# EAGLE design PX2IO (EAGLE 5.11)
BOM: EXCLUDE; PARTNO: *
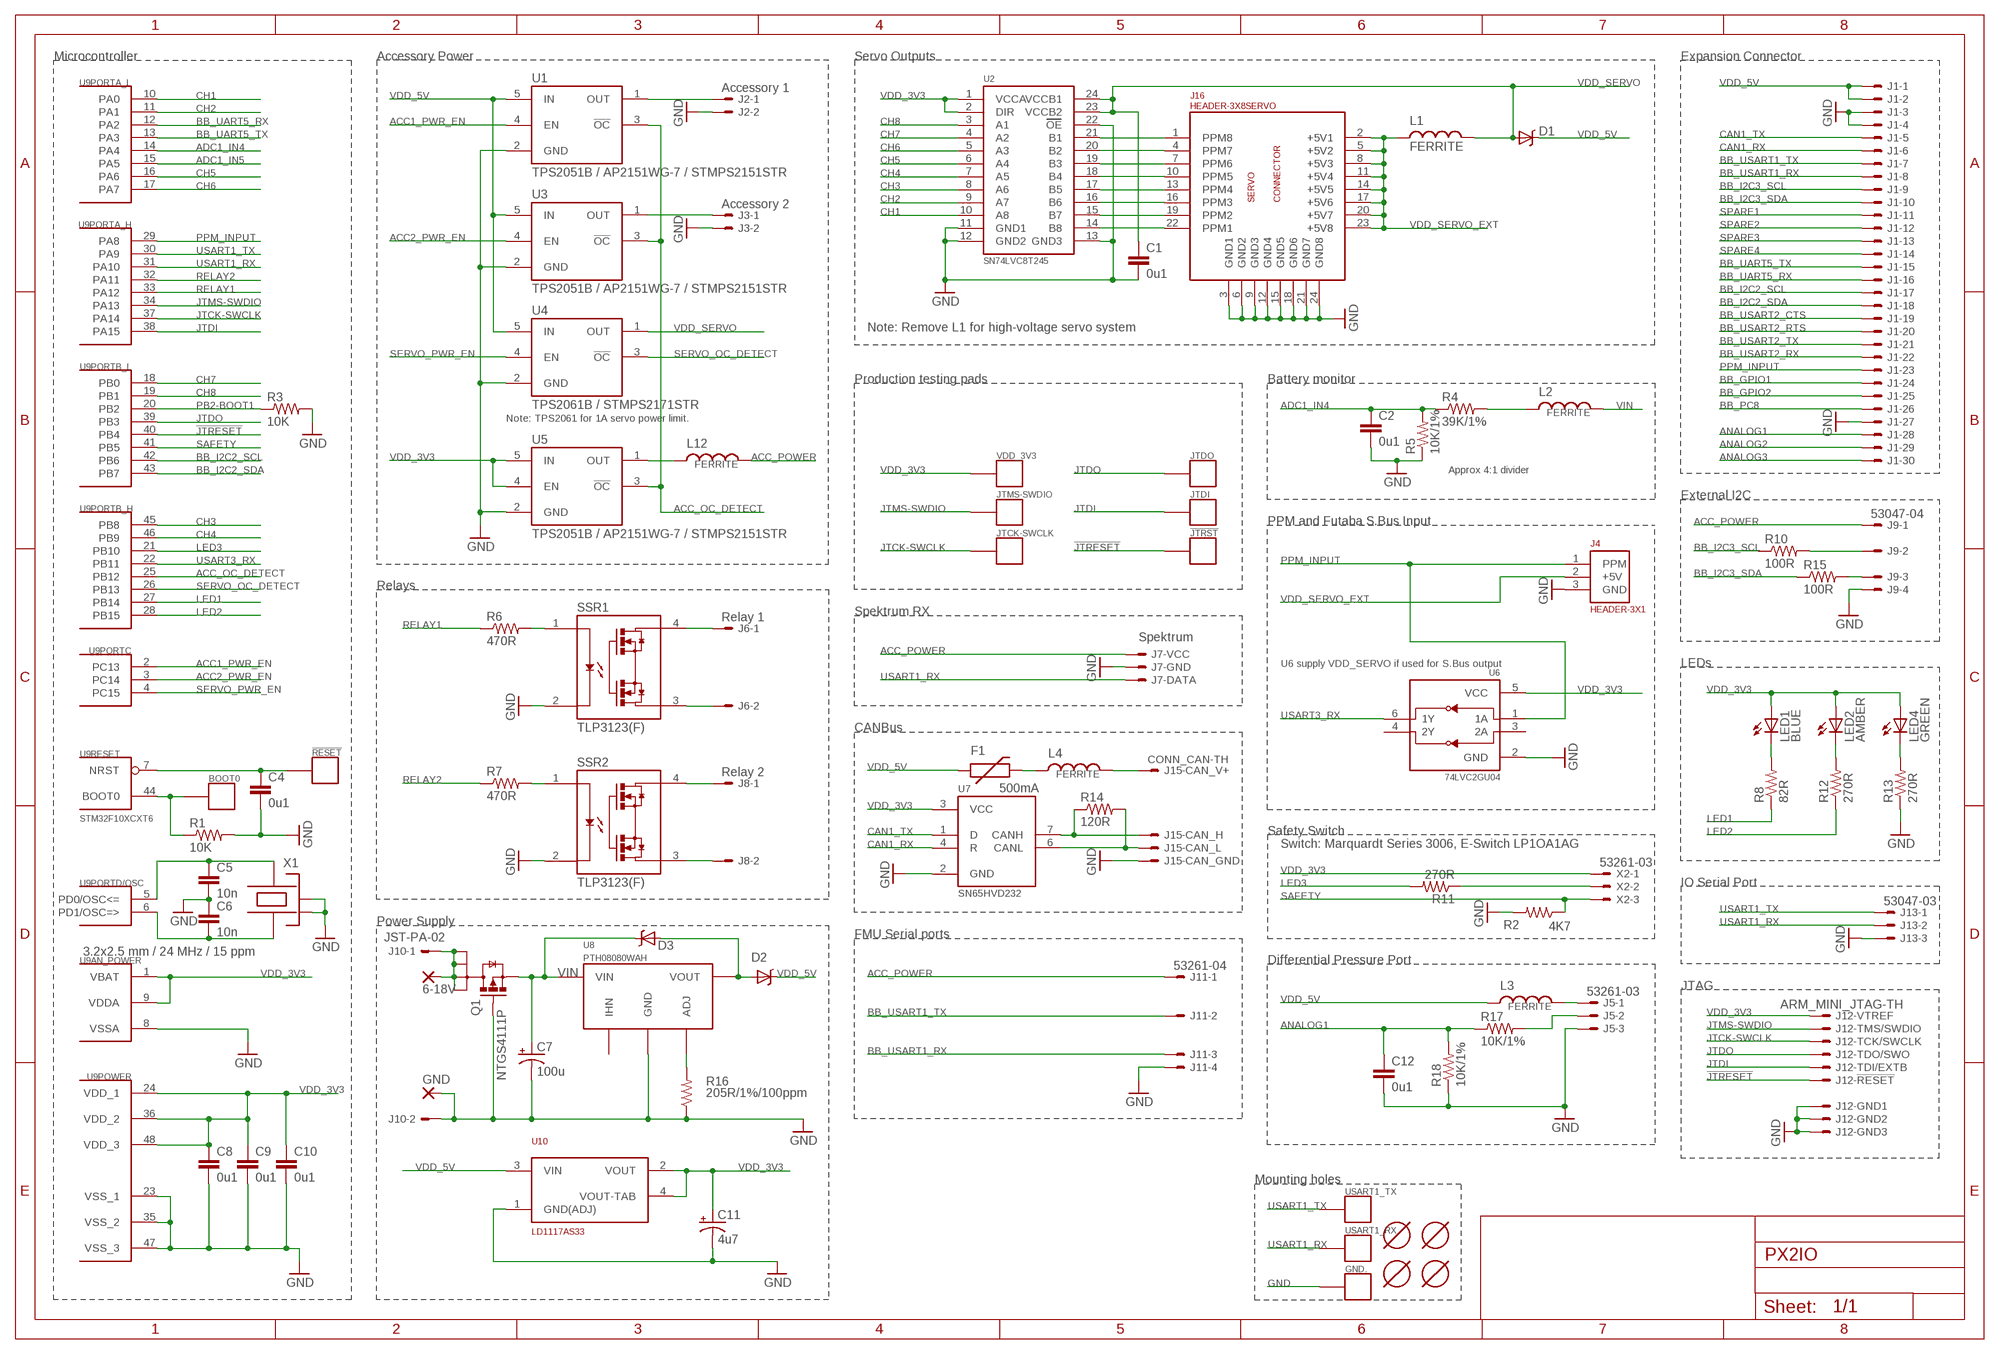
[diagram p0: schematic, sheet 1]

## Parts
6-18V  WIREPADSMD3,5-2  [3,5-2]
!JTRST  PAD.03  [PAD.03X.03]
!RESET  PAD.03  [PAD.03X.03]
BOOT0  PAD.03  [PAD.03X.03]
C1  0u1  CAP0402-CAP  [0402-CAP]
C2  0u1  CAP0402-CAP  [0402-CAP]
C4  0u1  CAP0402-CAP  [0402-CAP]
C5  10n  CAP0402-CAP  [0402-CAP]
C6  10n  CAP0402-CAP  [0402-CAP]
C7  100u  CAP_POL7343  [EIA7343]
C8  0u1  CAP0402-CAP  [0402-CAP]
C9  0u1  CAP0402-CAP  [0402-CAP]
C10  0u1  CAP0402-CAP  [0402-CAP]
C11  4u7  CAP_POL1206  [EIA3216]
C12  0u1  CAP0402-CAP  [0402-CAP]
D1  DIODE-SCHOTTKY_MSMP  [MICROSMP]
D2  DIODE-SCHOTTKY_MSMP  [MICROSMP]
D3  DIODE-SCHOTTKY_MSMP  [MICROSMP]
F1  500mA  PTC0603  [0603]
GND  WIREPADSMD3,5-2  [3,5-2]
GND.  PAD.03  [PAD.03X.03]
J1  HEADER_2X15-REV  [HEADER_2MM_2X15_REVERSE]
J2  Accessory 1  53047-02  [53047-02]
J3  Accessory 2  53047-02  [53047-02]
J4  HEADER-3X1  [3X1RA]
J5  53261-03  [53261-03]
J6  Relay 1  53047-02  [53047-02]
J7  CONN_SPEKTRUM_RX-TH  [B3B-ZR]
J8  Relay 2  53047-02  [53047-02]
J9  53047-04  [53047-04]
J10  JST-PA-02  [S02B-PASK-2]
J11  53261-04  [53261-04]
J12  ARM_MINI_JTAG-TH  [FTSH-105-01-XXX-DV]
J13  53047-03  [53047-03]
J15  CONN_CAN-TH  [B4B-PH-K-S]
J16  HEADER-3X8SERVO  [3X8RA]
JTCK-SWCLK  PAD.03  [PAD.03X.03]
JTDI  PAD.03  [PAD.03X.03]
JTDO  PAD.03  [PAD.03X.03]
JTMS-SWDIO  PAD.03  [PAD.03X.03]
L1  FERRITE  INDUCTOR0402  [0402-IND]
L2  FERRITE  INDUCTOR0402  [0402-IND]
L3  FERRITE  INDUCTOR0402  [0402-IND]
L4  FERRITE  INDUCTOR0402  [0402-IND]
L12  FERRITE  INDUCTOR0402  [0402-IND]
LED1  BLUE  LED0603  [LED-0603]
LED2  AMBER  LED0603  [LED-0603]
LED4  GREEN  LED0603  [LED-0603]
Q1  NTGS4111P  [TSOP-6]
R1  10K  RESISTOR0402-RES  [0402-RES]
R2  4K7  RESISTOR0402-RES  [0402-RES]
R3  10K  RESISTOR0402-RES  [0402-RES]
R4  39K/1%  RESISTOR0402-RES  [0402-RES]
R5  10K/1%  RESISTOR0402-RES  [0402-RES]
R6  470R  RESISTOR0402-RES  [0402-RES]
R7  470R  RESISTOR0402-RES  [0402-RES]
R8  82R  RESISTOR0402-RES  [0402-RES]
R10  100R  RESISTOR0402-RES  [0402-RES]
R11  270R  RESISTOR0402-RES  [0402-RES]
R12  270R  RESISTOR0402-RES  [0402-RES]
R13  270R  RESISTOR0402-RES  [0402-RES]
R14  120R  RESISTOR0402-RES  [0402-RES]
R15  100R  RESISTOR0402-RES  [0402-RES]
R16  205R/1%/100ppm  RESISTOR0402-RES  [0402-RES]
R17  10K/1%  RESISTOR0402-RES  [0402-RES]
R18  10K/1%  RESISTOR0402-RES  [0402-RES]
SSR1  TLP3123(F)  TLP3123SO  [SOP4-2.54]
SSR2  TLP3123(F)  TLP3123SO  [SOP4-2.54]
U1  TPS2051B / AP2151WG-7 / STMPS2151STR  TPS2051B  [SOT23-5L]
U2  SN74LVC8T245  [R-PDSO-G24]
U3  TPS2051B / AP2151WG-7 / STMPS2151STR  TPS2051B  [SOT23-5L]
U4  TPS2061B / STMPS2171STR  TPS2051B  [SOT23-5L]
U5  TPS2051B / AP2151WG-7 / STMPS2151STR  TPS2051B  [SOT23-5L]
U6  74LVC2GU04  [SOT363_PHILIPS]
U7  SN65HVD232  [SO08]
U8  PTH08080WAH  [PTH08080W_TH]
U9  STM32F10XCXT6  [TQFP48]
U10  LD1117AS33  [SOT-223]
U$2  MOUNT-HOLE2.1MM  [MOUNT-HOLE2.1]
U$3  MOUNT-HOLE2.1MM  [MOUNT-HOLE2.1]
U$4  MOUNT-HOLE2.1MM  [MOUNT-HOLE2.1]
U$5  MOUNT-HOLE2.1MM  [MOUNT-HOLE2.1]
USART1_RX  PAD.03  [PAD.03X.03]
USART1_TX  PAD.03  [PAD.03X.03]
VDD_3V3  PAD.03  [PAD.03X.03]
X1  3.2x2.5 mm / 24 MHz / 15 ppm  OSCILLATOR-3.2X2.5  [OSCILLATOR-3.2X2.5]
X2  53261-03  [53261-03]

## Nets
!JTRESET: !JTRST.P$1 J12.10 U9.40(PORTB_L:PB4)
ACC1_PWR_EN: U1.4(EN) U9.2(PORTC:PC13)
ACC2_PWR_EN: U3.4(EN) U9.3(PORTC:PC14)
ACC_OC_DETECT: U1.3(!OC) U3.3(!OC) U5.3(!OC) U9.25(PORTB_H:PB12)
ACC_POWER [power]: J7.3 J9.1 J11.1 L12.2
ADC1_IN4: C2.1 R4.1 R5.2 U9.14(PORTA_L:PA4)
ADC1_IN5: U9.15(PORTA_L:PA5)
ANALOG1: C12.1 J1.28 R17.1 R18.2
ANALOG2: J1.29
ANALOG3: J1.30
BB_GPIO1: J1.24
BB_GPIO2: J1.25
BB_I2C2_SCL: J1.17 U9.42(PORTB_L:PB6)
BB_I2C2_SDA: J1.18 U9.43(PORTB_L:PB7)
BB_I2C3_SCL: J1.9 R10.1
BB_I2C3_SDA: J1.10 R15.1
BB_PC8: J1.26
BB_UART5_RX: J1.16 U9.12(PORTA_L:PA2)
BB_UART5_TX: J1.15 U9.13(PORTA_L:PA3)
BB_USART1_RX: J1.8 J11.3
BB_USART1_TX: J1.7 J11.2
BB_USART2_CTS: J1.19
BB_USART2_RTS: J1.20
BB_USART2_RX: J1.22
BB_USART2_TX: J1.21
BOOT0: BOOT0.P$1 R1.1 U9.44(RESET:BOOT0)
CAN1_RX: J1.6 U7.4(R)
CAN1_TX: J1.5 U7.1(D)
CH1: U2.10(A8) U9.10(PORTA_L:PA0)
CH2: U2.9(A7) U9.11(PORTA_L:PA1)
CH3: U2.8(A6) U9.45(PORTB_H:PB8)
CH4: U2.7(A5) U9.46(PORTB_H:PB9)
CH5: U2.6(A4) U9.16(PORTA_L:PA6)
CH6: U2.5(A3) U9.17(PORTA_L:PA7)
CH7: U2.4(A2) U9.18(PORTB_L:PB0)
CH8: U2.3(A1) U9.19(PORTB_L:PB1)
GND [power]: C1.2 C2.2 C4.2 C5.2 C6.1 C7.C(-) C8.2 C9.2 C10.2 C11.C(-) C12.2 GND.1(P) GND..P$1 J1.3 J1.4 J1.27 J2.2 J3.2 J4.3(GND) J5.3 J7.2 J9.4 J10.2 J11.4 J12.3 J12.5 J12.9 J13.3 J15.4 J16.3(GND1) J16.6(GND2) J16.9(GND3) J16.12(GND4) J16.15(GND5) J16.18(GND6) J16.21(GND7) J16.24(GND8) Q1.3(G) R1.2 R2.2 R3.2 R5.1 R13.1 R16.1 R18.1 SSR1.2 SSR2.2 U1.2(GND) U2.11(GND1) U2.12(GND2) U2.13(GND3) U2.22(OE) U3.2(GND) U4.2(GND) U5.2(GND) U6.2(GND) U7.2(GND) U8.2(GND) U9.8(AN_POWER:VSSA) U9.23(POWER:VSS_1) U9.35(POWER:VSS_2) U9.47(POWER:VSS_3) U10.1(GND(ADJ)) X1.2(NC_2) X1.4(NC_4)
JTCK-SWCLK: J12.4 JTCK-SWCLK.P$1 U9.37(PORTA_H:PA14)
JTDI: J12.8 JTDI.P$1 U9.38(PORTA_H:PA15)
JTDO: J12.6 JTDO.P$1 U9.39(PORTB_L:PB3)
JTMS-SWDIO: J12.2 JTMS-SWDIO.P$1 U9.34(PORTA_H:PA13)
LED1: R8.1 U9.27(PORTB_H:PB14)
LED2: R12.1 U9.28(PORTB_H:PB15)
LED3: R11.2 U9.21(PORTB_H:PB10)
N$1: R7.2 SSR2.1
N$2: R6.2 SSR1.1
N$4 [power]: L12.1 U5.1(OUT)
N$5: C6.2 U9.6(PORTD/OSC:PD1/OSC=>) X1.1
N$6: C5.1 U9.5(PORTD/OSC:PD0/OSC<=) X1.3
N$7: L2.1 R4.2
N$8: LED1.C R8.2
N$9: R16.2 U8.4(ADJ)
N$10: R11.1 X2.2
N$14: F1.2 L4.1
N$15: J5.2 R17.2
N$21 [power]: J8.1 SSR2.4
N$22 [power]: J8.2 SSR2.3
N$23 [power]: J6.2 SSR1.3
N$24 [power]: J6.1 SSR1.4
N$27: J9.3 R15.2
N$28: J9.2 R10.2
N$29 [power]: J2.1 U1.1(OUT)
N$30 [power]: J3.1 U3.1(OUT)
N$31: LED2.C R12.2
N$38: LED4.C R13.2
N$43: J15.2 R14.1 U7.7(CANH)
N$44: J15.3 R14.2 U7.6(CANL)
N$47 [power]: J15.1 L4.2
NRST: !RESET.P$1 C4.1 U9.7(RESET:NRST)
PB2-BOOT1: R3.1 U9.20(PORTB_L:PB2)
PPM1: J16.22(PPM1) U2.14(B8)
PPM2: J16.19(PPM2) U2.15(B7)
PPM3: J16.16(PPM3) U2.16(B6)
PPM4: J16.13(PPM4) U2.17(B5)
PPM5: J16.10(PPM5) U2.18(B4)
PPM6: J16.7(PPM6) U2.19(B3)
PPM7: J16.4(PPM7) U2.20(B2)
PPM8: J16.1(PPM8) U2.21(B1)
PPM_INPUT: J1.23 J4.1(PPM) U6.1(1A) U9.29(PORTA_H:PA8)
RELAY1: R6.1 U9.33(PORTA_H:PA12)
RELAY2: R7.1 U9.32(PORTA_H:PA11)
SAFETY: R2.1 U9.41(PORTB_L:PB5) X2.3
SERVO_OC_DETECT: U4.3(!OC) U9.26(PORTB_H:PB13)
SERVO_PWR_EN: U4.4(EN) U9.4(PORTC:PC15)
SPARE1: J1.11
SPARE2: J1.12
SPARE3: J1.13
SPARE4: J1.14
USART1_RX: J7.1 J13.2 U9.31(PORTA_H:PA10) USART1_RX.P$1
USART1_TX: J13.1 U9.30(PORTA_H:PA9) USART1_TX.P$1
USART3_RX: U6.6(1Y) U9.22(PORTB_H:PB11)
VDD_3V3 [power]: C8.1 C9.1 C10.1 C11.A(+) J12.1 LED1.A LED2.A LED4.A U2.1(VCCA) U2.2(DIR) U5.4(EN) U5.5(IN) U6.5(VCC) U7.3(VCC) U9.1(AN_POWER:VBAT) U9.9(AN_POWER:VDDA) U9.24(POWER:VDD_1) U9.36(POWER:VDD_2) U9.48(POWER:VDD_3) U10.2(VOUT) U10.4(VOUT-TAB) VDD_3V3.P$1 X2.1
VDD_5V [power]: D1.CATHODE(C) D2.CATHODE(C) F1.1 J1.1 J1.2 L3.1 U1.5(IN) U3.5(IN) U4.5(IN) U10.3(VIN)
VDD_5V_ANALOG [power]: J5.1 L3.2
VDD_SERVO [power]: C1.1 D1.ANODE(A) L1.2 U2.23(VCCB2) U2.24(VCCB1) U4.1(OUT)
VDD_SERVO_EXT [power]: J4.2(+5V) J16.2(+5V1) J16.5(+5V2) J16.8(+5V3) J16.11(+5V4) J16.14(+5V5) J16.17(+5V6) J16.20(+5V7) J16.23(+5V8) L1.1
VIN [power]: C7.A(+) D3.CATHODE(C) L2.2 Q1.4(S) U8.1(VIN)
VIN_CONTACT [power]: 6-18V.1(P) J10.1 Q1.1(D) Q1.2(D1) Q1.5(D2) Q1.6(D3)
VOUT: D2.ANODE(A) D3.ANODE(A) U8.3(VOUT)
Unconnected: U6.3(2A) U6.4(2Y) U7.5(NC) U7.8(NC2) U8.5(IHN)

## Notes on the sheet
- Microcontroller | Accessory Power | Servo Outputs | Expansion Connector
- Note: Remove L1 for high-voltage servo system
- Production testing pads | Battery monitor
- Note: TPS2061 for 1A servo power limit.
- Approx 4:1 divider
- External I2C
- PPM and Futaba S.Bus Input
- Relays
- Spektrum RX
- Spektrum
- U6 supply VDD_SERVO if used for S.Bus output | LEDs
- CANBus
- Safety Switch
- Switch: Marquardt Series 3006, E-Switch LP1OA1AG
- IO Serial Port
- Power Supply
- FMU Serial ports
- Differential Pressure Port
- JTAG
- Mounting holes

## Library data of the parts
6-18V GND = pixhawk2:WIREPAD: Wire PAD connect wire on PCB
!JTRST !RESET BOOT0 GND. JTCK-SWCLK JTDI JTDO JTMS-SWDIO USART1_RX USART1_TX VDD_3V3 = pixhawk2:PAD: Test pad This footprint includes three classes: The actual test pads, a pogo-pin footprint to mount the pogo-pin as through-hole part and a hole footprint which allows the head of the pogo-pin to pass through (do NOT use the hole to mount the pogo-pin). In a typical test setup, the stack would consist of three PCBs: The actual PCB under testing with a test pad on the bottom, then a second PCB with the hole for the pogo-pin head where the PCB under testing is pressed on and a third PCB at 30 mm / 1.2" distance with the pogo-pin footprints. The pogo-pins are soldered to the last PCB. To create the stack, copy the board under testing and exchange the footprints - this way the correct positioning is ensured.
C1 C2 C4-C6 C8-C10 C12 = pixhawk2:CAP: Capacitor Standard 0603 ceramic capacitor, and 0.1" leaded capacitor.
C7 C11 = pixhawk2:CAP_POL: Capacitor Polarized These are standard SMD and PTH capacitors. Normally 10uF, 47uF, and 100uF in electrolytic and tantalum varieties. Always verify the external diameter of the through hole cap, it varies with capacity, voltage, and manufacturer. The EIA devices should be standard.
D1-D3 = pixhawk2:DIODE-SCHOTTKY: Schottky barrier diode in DO214AC, e.g. Fairchild SS14.
F1 = pixhawk2:PTC: Resettable Fuse PTC Resettable Fuse. Spark Fun Electronics SKU : COM-08357
J1 = pixhawk2:HEADER_2X15: 2X15 header
J2 J3 J6 J8 = pixhawk2:53?-02: CONNECTOR wire to board 1.25 mm (.049 inch) pitch header
J4 = pixhawk2:HEADER-3X1
J5 J13 X2 = pixhawk2:53?-03: CONNECTOR wire to board 1.25 mm (.049 inch) pitch header
J7 = pixhawk2:CONN_SPEKTRUM_RX: Spektrum RX connector; JST ZH series S3B-ZR-SM4A-TF
J9 J11 = pixhawk2:53?-04: CONNECTOR wire to board 1.25 mm (.049 inch) pitch header
J10 = pixhawk2:JST-PA-02: JST PA Series http://www.jst-mfg.com/product/pdf/eng/ePA-F.pdf
J12 = pixhawk2:ARM_MINI_JTAG: CONNECTOR wire to board 1.25 mm (.049 inch) pitch header
J15 = pixhawk2:CONN_CAN
J16 = pixhawk2:HEADER-3X8
L1-L4 L12 = pixhawk2:INDUCTOR: Inductors Basic Inductor/Choke - 0603 and 1206. Footprints are not proven and vary greatly between part numbers.
LED1 LED2 LED4 = pixhawk2:LED: LEDs Standard schematic elements and footprints for 5mm, 3mm, 1206, and 0603 sized LEDs. 5mm - Spark Fun Electronics SKU : COM-00529 (and others)
Q1 = pixhawk2:NTGS4111P
R1-R8 R10-R18 = pixhawk2:RESISTOR: Resistor Basic schematic elements and footprints for 0603, 1206, and PTH 1/10th watt (small) resistors.
SSR1 SSR2 = pixhawk2:TLP3123: TLP3123 Solid State Relay The TOSHIBA TLP3123 consists of a gallium arsenide infrared emitting diode optically coupled to a photo-MOS FET in a plastic SOP package. The TLP3123 is a bi-directional switch, which can replace mechanical relays in many applications. And its high on-state current maximum rating and low on-state resistance is suitable to control a power line. http://www.semicon.toshiba.co.jp/docs/datasheet/en/Opto/TLP3123_en_datasheet_071001.pdf
U1 U3-U5 = pixhawk2:TPS2051B: CURRENT-LIMITED, POWER-DISTRIBUTION SWITCH The TPS204xB/TPS205xB power-distribution switches are intended for applications where heavy capacitive loads and short circuits are likely to be encountered. 500-mA continuous current, accurate Current Limit (0.75 A min, 1.25 A max), operating range: 2.7 V to 5.5 V. These devices incorporates 70-m? N-channel MOSFET power switches for power-distribution systems that require multiple power switches in a single package. Each switch is controlled by a logic enable input. Gate drive is provided by an internal charge pump designed to control the power-switch rise times and fall times to minimize current surges during switching. The charge pump requires no external components and allows operation from supplies as low as 2.7 V. http://focus.ti.com/lit/ds/symlink/tps2051b.pdf
U2 = pixhawk2:SN74LVC8T245
U6 = pixhawk2:74LVC2GU04: DUAL INVERTER GATE This dual inverter is designed for 1.65-V to 5.5-V VCC operation. The SN74LVC2GU04 contains two inverters with unbuffered outputs and performs the Boolean function Y = A. It is available from NXP and TI. http://www.nxp.com/documents/data_sheet/74LVC2GU04.pdf http://focus.ti.com/lit/ds/symlink/sn74lvc2gu04.pdf
U7 = pixhawk2:SN65HVD232: 3.3-V CAN TRANSCEIVER
U8 = pixhawk2:PTH08080W: 2.25-A, WIDE-INPUT ADJUSTABLE SWITCHING REGULATOR The input voltage range of the PTH08080W is from 4.5 V to 18 V, allowing operation from either a 5-V or 12-V input bus. Using state-of-the-art switched-mode power-conversion technology, the PTH08080W can step down to voltages as low as 0.9 V from a 5-V input bus, with less than 1 W of power dissipation. The output voltage can be adjusted to any voltage over the range, 0.9 V to 5.5 V, using a single external resistor. Operating features include an undervoltage lockout (UVLO), on/off inhibit, overcurrent protection, and overtemperature protection. http://focus.ti.com/lit/ds/symlink/pth08080w.pdf
U9 = pixhawk2:STM32F10XCXT6: ST STM32F101/103 48pin LQFP
U10 = pixhawk2:LD1117A: LD1117A LDO Datasheet: http://www.st.com/stonline/books/pdf/docs/7194.pdf
U$2-U$5 = pixhawk2:MOUNT-HOLE
X1 = pixhawk2:OSCILLATOR: Crystal Oscillator in 3.2x2.5 SMD

## Net classes
0 signal: width 0.203 mm, drill 0.3 mm, clearance 0.203 mm
1 power: width 0.254 mm, drill 0.3 mm, clearance 0.203 mm

## Board
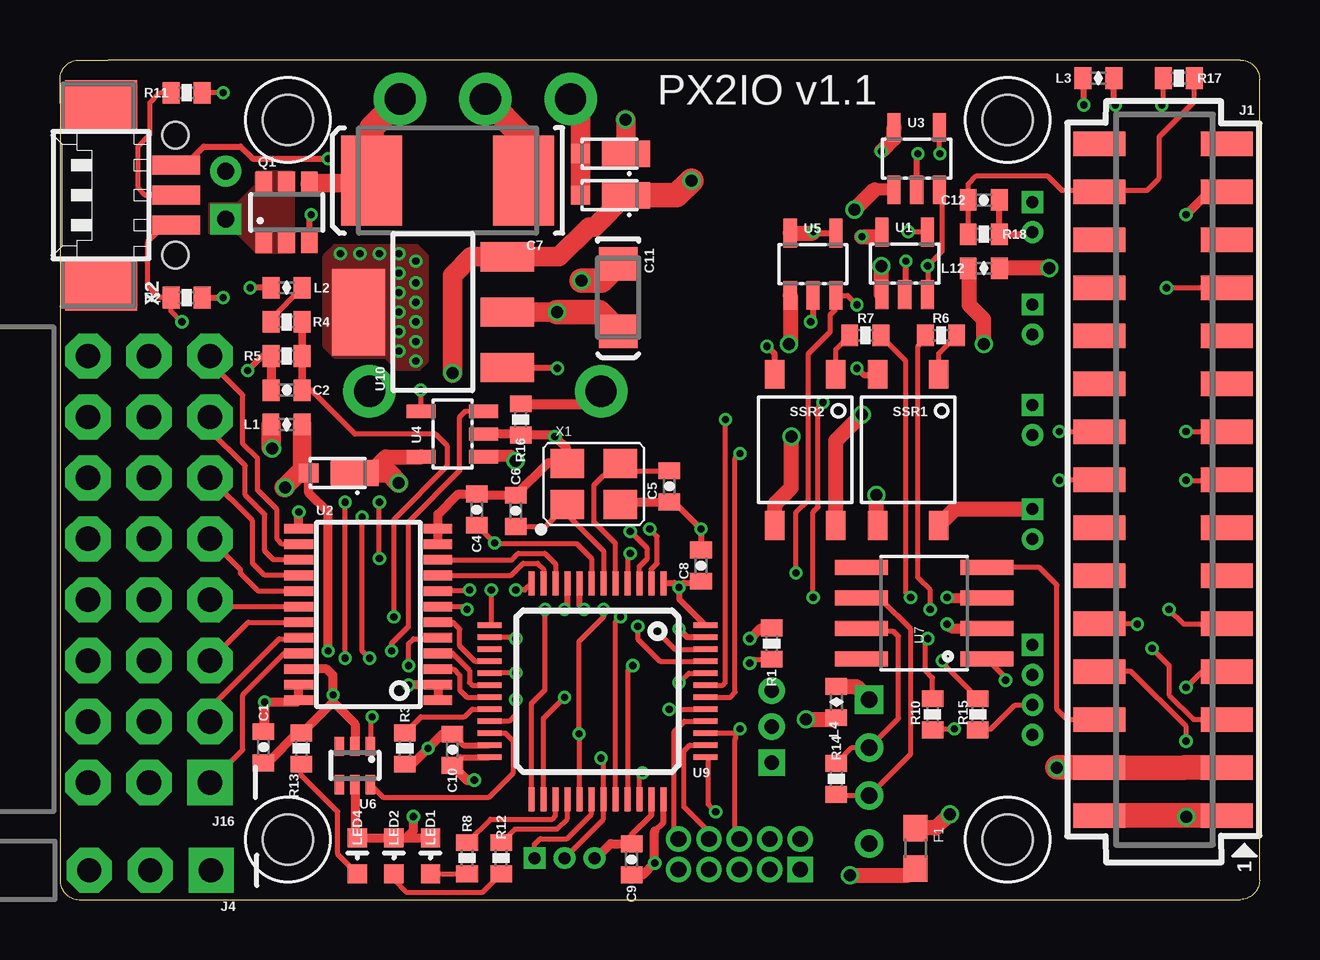
[diagram p1: board, top side]
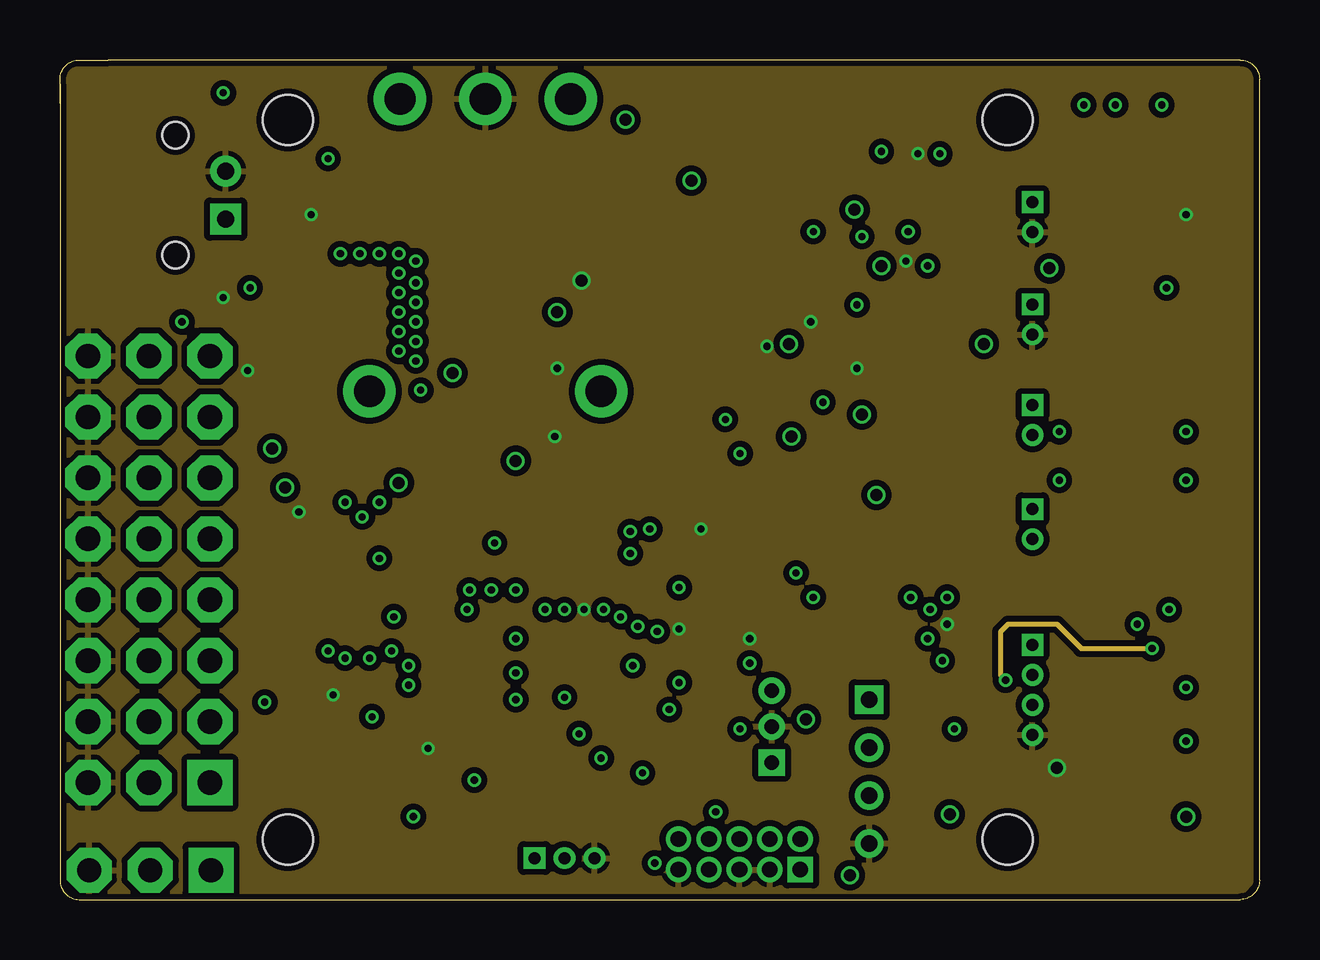
[diagram p2: board, inner layer Route2]
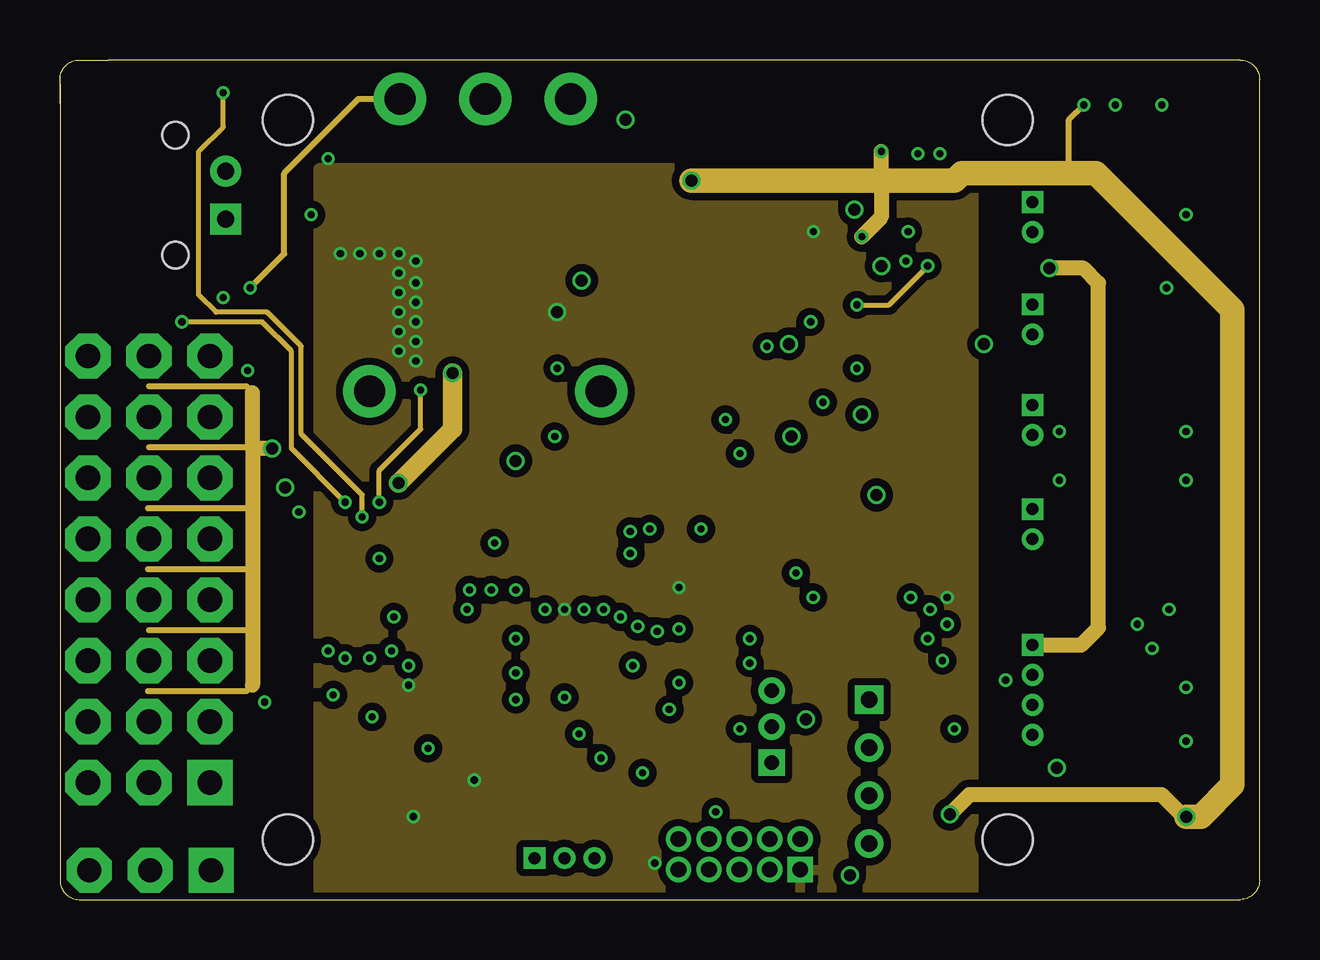
[diagram p3: board, inner layer Route15]
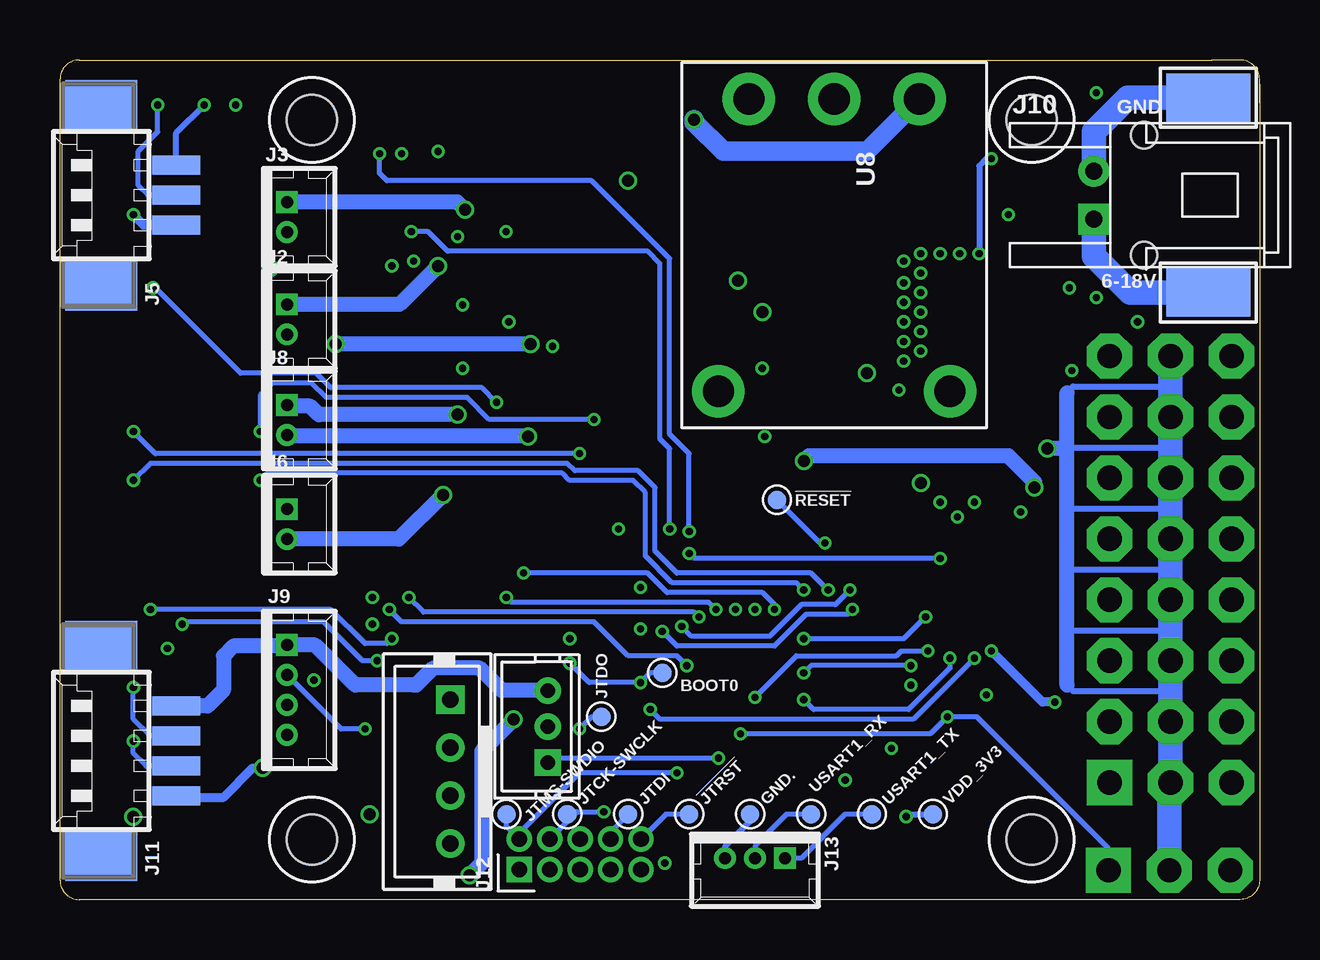
[diagram p4: board, bottom side, seen from below]

Size 50 x 35 mm. Coordinates in mm from the lower left corner, seen from the top.
Outline: 0,33.2 0,34.2 arc-90 0.8,35 1,35 2,35 35.2,35
Outline: 0,34 0,0.8 arc90 0.8,0 49.2,0 arc90 50,0.8 50,34.2 arc90 49.2,35 35.21,35
Copper layers (1*2*15*16): Top 0.035mm / dielectric 0.5mm / Route2 0.035mm / dielectric 0.5mm / Route15 0.035mm / dielectric 0.5mm / Bottom 0.035mm
Design rules "pixhawk2 *": minimum track width 0.15mm, minimum drill 0.3mm, track to track 0.15mm, track to pad 0.15mm, pad to pad 0.15mm, via to via 0.15mm, smd to smd 0.15mm, copper to edge 0.2mm, drill to drill 0.2mm, minimum pad ring 0.125mm, minimum via ring 0.125mm, stop-mask expansion 0.075mm, vias tented up to drill 0.31mm, thermal gap 8mil

### Footprints (pad centres in the part's own frame; a part is rotated, then mirrored left to right if it is on the bottom)
3,5-2 = smd 2 x 3.5: 1 0,0
PAD.03X.03 = smd 0.762 x 0.762: P$1 0,0
0402-CAP = smd 0.7 x 0.9: 1 -0.65,0; 2 0.65,0
EIA7343 = smd 2.55 x 3.75: A 3.17,0; C -3.17,0
EIA3216 = smd 1.4 x 1.6: A 1.4,0; C -1.4,0
MICROSMP = smd 0.8 x 0.8: ANODE 0.65,0 | smd 2 x 1.1: CATHODE -1.25,0
0603 = smd 1.1 x 1: 1 -0.85,0; 2 0.85,0
HEADER_2MM_2X15_REVERSE = smd 1.02 x 2.16: 1 -14,-2.655; 2 -14,2.655; 3 -12,-2.655; 4 -12,2.655; 5 -10,-2.655; 6 -10,2.655; 7 -8,-2.655; 8 -8,2.655; 9 -6,-2.655; 10 -6,2.655; 11 -4,-2.655; 12 -4,2.655; 13 -2,-2.655; 14 -2,2.655; 15 0,-2.655; 16 0,2.655; 17 2,-2.655; 18 2,2.655; 19 4,-2.655; 20 4,2.655; 21 6,-2.655; 22 6,2.655; 23 8,-2.655; 24 8,2.655; 25 10,-2.655; 26 10,2.655; 27 12,-2.655; 28 12,2.655; 29 14,-2.655; 30 14,2.655
53047-02 = drill 0.5 pad 0.9 square: 1 -0.625,0 | drill 0.5 pad 0.9 round: 2 0.625,0
3X1RA = drill 1.016 pad 1.88 square: 1 -5.08,0 | drill 1.016 pad 1.88 octagon: 2 -2.54,0; 3 0,0
53261-03 = smd 0.8 x 2: 1 1.25,-2.5; 2 0,-2.5; 3 -1.25,-2.5 | smd 2.1 x 3: S1 3.75,0.625; S2 -3.75,0.625
B3B-ZR = drill 0.6 pad 1.1 square: 1 -1.5,0 | drill 0.6 pad 1.1 round: 2 0,0; 3 1.5,0
53047-04 = drill 0.5 pad 0.9 square: 1 -1.875,0 | drill 0.5 pad 0.9 round: 2 -0.625,0; 3 0.625,0; 4 1.875,0
S02B-PASK-2 = drill 0.7 pad 1.3 square: 1 1,0 | drill 0.7 pad 1.3 round: 2 -1,0 | hole 1.1: -2.5,2.1; 2.5,2.1
53261-04 = smd 0.8 x 2: 1 1.875,-2.5; 2 0.625,-2.5; 3 -0.625,-2.5; 4 -1.875,-2.5 | smd 2.1 x 3: S1 4.375,0.625; S2 -4.375,0.625
FTSH-105-01-XXX-DV = drill 0.65 pad 1.06 square: 1 0,0 | drill 0.65 pad 1.06 round: 2 0,1.27; 3 1.27,0; 4 1.27,1.27; 5 2.54,0; 6 2.54,1.27; 7 3.81,0; 8 3.81,1.27; 9 5.08,0; 10 5.08,1.27
53047-03 = drill 0.5 pad 0.9 square: 1 -1.25,0 | drill 0.5 pad 0.9 round: 2 0,0; 3 1.25,0
B4B-PH-K-S = drill 0.7 pad 1.2 square: 1 6,0 | drill 0.7 pad 1.2 round: 2 4,0; 3 2,0; 4 0,0
3X8RA = drill 1.016 pad 1.88 square: 1 -1.27,8.89 | drill 1.016 pad 1.88 octagon: 2 1.27,8.89; 3 3.81,8.89; 4 -1.27,6.35; 5 1.27,6.35; 6 3.81,6.35; 7 -1.27,3.81; 8 1.27,3.81; 9 3.81,3.81; 10 -1.27,1.27; 11 1.27,1.27; 12 3.81,1.27; 13 -1.27,-1.27; 14 1.27,-1.27; 15 3.81,-1.27; 16 -1.27,-3.81; 17 1.27,-3.81; 18 3.81,-3.81; 19 -1.27,-6.35; 20 1.27,-6.35; 21 3.81,-6.35; 22 -1.27,-8.89; 23 1.27,-8.89; 24 3.81,-8.89
0402-IND = smd 0.7 x 0.9: 1 -0.65,0; 2 0.65,0
LED-0603 = smd 0.8 x 0.8: A 0,-0.75; C 0,0.75
TSOP-6 = smd 0.7 x 1: 1 -0.95,-1.2; 2 0,-1.2; 3 0.95,-1.2; 4 0.95,1.2; 5 0,1.2; 6 -0.95,1.2
0402-RES = smd 0.7 x 0.9: 1 -0.65,0; 2 0.65,0
SOP4-2.54 = smd 0.8 x 1.2: 1 -1.27,-3.15; 2 1.27,-3.15; 3 1.27,3.15; 4 -1.27,3.15
SOT23-5L = smd 0.55 x 1.2: 1 -0.95,-1.3; 2 0,-1.3; 3 0.95,-1.3; 4 0.95,1.3; 5 -0.95,1.3
R-PDSO-G24 = smd 0.4 x 1.2: 1 -3.575,-2.9; 2 -2.925,-2.9; 3 -2.275,-2.9; 4 -1.625,-2.9; 5 -0.975,-2.9; 6 -0.325,-2.9; 7 0.325,-2.9; 8 0.975,-2.9; 9 1.625,-2.9; 10 2.275,-2.9; 11 2.925,-2.9; 12 3.575,-2.9; 13 3.575,2.9; 14 2.925,2.9; 15 2.275,2.9; 16 1.625,2.9; 17 0.975,2.9; 18 0.325,2.9; 19 -0.325,2.9; 20 -0.975,2.9; 21 -1.625,2.9; 22 -2.275,2.9; 23 -2.925,2.9; 24 -3.575,2.9
SOT363_PHILIPS = smd 0.4 x 0.8: 1 -0.65,-0.8; 2 0,-0.8; 3 0.65,-0.8; 4 0.65,0.8; 5 0,0.8; 6 -0.65,0.8
SO08 = smd 0.61 x 2.21: 1 -1.905,-2.616; 2 -0.635,-2.616; 3 0.635,-2.616; 4 1.905,-2.616; 5 1.905,2.616; 6 0.635,2.616; 7 -0.635,2.616; 8 -1.905,2.616
PTH08080W_TH = drill 1.3 pad 2.184 round: 1 -6.096,3.556; 2 -6.096,0; 3 -6.096,-3.556; 4 6.096,-4.826; 5 6.096,4.826
TQFP48 = smd 0.24 x 1: 1 -2.75,-4.5; 2 -2.25,-4.5; 3 -1.75,-4.5; 4 -1.25,-4.5; 5 -0.75,-4.5; 6 -0.25,-4.5; 7 0.25,-4.5; 8 0.75,-4.5; 9 1.25,-4.5; 10 1.75,-4.5; 11 2.25,-4.5; 12 2.75,-4.5; 25 2.75,4.5; 26 2.25,4.5; 27 1.75,4.5; 28 1.25,4.5; 29 0.75,4.5; 30 0.25,4.5; 31 -0.25,4.5; 32 -0.75,4.5; 33 -1.25,4.5; 34 -1.75,4.5; 35 -2.25,4.5; 36 -2.75,4.5 | smd 1 x 0.24: 13 4.5,-2.75; 14 4.5,-2.25; 15 4.5,-1.75; 16 4.5,-1.25; 17 4.5,-0.75; 18 4.5,-0.25; 19 4.5,0.25; 20 4.5,0.75; 21 4.5,1.25; 22 4.5,1.75; 23 4.5,2.25; 24 4.5,2.75; 37 -4.5,2.75; 38 -4.5,2.25; 39 -4.5,1.75; 40 -4.5,1.25; 41 -4.5,0.75; 42 -4.5,0.25; 43 -4.5,-0.25; 44 -4.5,-0.75; 45 -4.5,-1.25; 46 -4.5,-1.75; 47 -4.5,-2.25; 48 -4.5,-2.75
SOT-223 = smd 1.219 x 2.235: 1 -2.311,-3.099; 2 0,-3.099; 3 2.311,-3.099 | smd 3.6 x 2.2: 4 0,3.099
MOUNT-HOLE2.1 = hole 2.1: 0,0
OSCILLATOR-3.2X2.5 = smd 1.4 x 1.2: 1 -1.1,-0.85; 2 1.1,-0.85; 3 1.1,0.85; 4 -1.1,0.85

### Placement (x,y rotation side)
6-18V  2.13,25.3 90 bottom
!JTRST  23.77,3.56 45 bottom
!RESET  20.12,16.66 0 bottom
BOOT0  24.89,9.45 0 bottom
C1  8.48,6.35 270 top
C2  9.45,21.23 180 top
C4  17.37,16.26 90 top
C5  25.4,17.22 270 top
C6  19,16.21 270 top
C7  16.15,29.97 180 top
C8  26.72,13.92 90 top
C9  23.83,1.68 90 top
C10  16.36,6.25 90 top
C11  23.27,25.1 270 top
C12  38.51,29.16 0 top
D1  11.02,17.78 180 top
D2  22.35,29.36 180 top
D3  22.35,31.09 180 top
F1  35.66,2.13 270 top
GND  2.13,33.43 270 bottom
GND.  21.23,3.56 45 bottom
J1  45.97,17.51 90 top
J2  40.54,24.18 270 bottom
J3  40.54,28.45 270 bottom
J4  1.22,1.22 180 top
J5  47.65,29.36 90 bottom
J6  40.54,15.65 270 bottom
J7  29.67,7.21 90 bottom
J8  40.54,19.99 270 bottom
J9  40.54,8.74 270 bottom
J10  6.91,29.36 270 bottom
J11  47.65,6.2 90 bottom
J12  30.86,1.24 0 bottom
J13  21.03,1.73 180 bottom
J15  33.73,2.34 90 bottom
J16  4.98,13.77 180 top
JTCK-SWCLK  28.85,3.56 45 bottom
JTDI  26.31,3.56 45 bottom
JTDO  27.43,7.62 90 bottom
JTMS-SWDIO  31.39,3.56 45 bottom
L1  9.44,19.81 0 top
L2  9.45,25.5 180 top
L3  43.28,34.24 0 top
L4  32.36,8.23 90 top
L12  38.51,26.31 0 top
LED1  15.44,1.83 180 top
LED2  13.92,1.83 180 top
LED4  12.4,1.83 180 top
Q1  9.45,28.65 0 top
R1  29.67,10.67 90 top
R2  5.28,25.1 0 top
R3  14.38,6.3 270 top
R4  9.45,24.08 180 top
R5  9.45,22.66 0 top
R6  36.73,23.52 0 top
R7  33.57,23.52 180 top
R8  16.97,1.73 270 top
R10  36.37,7.72 270 top
R11  5.28,33.63 0 top
R12  18.39,1.73 270 top
R13  10.06,6.3 270 top
R14  32.36,5.03 270 top
R15  38.25,7.72 270 top
R16  19.2,20.02 90 top
R17  46.63,34.24 180 top
R18  38.51,27.74 180 top
SSR1  35.36,18.75 180 top
SSR2  31.06,18.75 180 top
U1  35.2,26.52 0 top
U2  12.85,11.89 90 top
U3  35.71,30.89 0 top
U4  16.36,19.41 90 top
U5  31.39,26.49 0 top
U6  12.29,5.59 180 top
U7  36.02,11.94 90 top
U8  17.73,27.28 270 bottom
U9  22.4,8.69 180 top
U10  15.54,24.49 90 top
U$2  39.5,32.5 0 top
U$3  9.5,32.5 0 top
U$4  39.5,2.5 0 top
U$5  9.5,2.5 0 top
USART1_RX  18.69,3.56 45 bottom
USART1_TX  16.15,3.56 45 bottom
VDD_3V3  13.61,3.56 45 bottom
X1  22.25,17.32 0 top
X2  2.34,29.36 90 top

### Tracks (layer width: path | path; a pad name or v marks a point on that pad's centre or on a via)
!JTRESET
  Top 0.203: U9.40 26.03,7.44 25.6,7.01 25.6,2.69 J12.10
  Bottom 0.203: !JTRST.P$1 24.74,3.56 J12.10
ACC1_PWR_EN  (via drill 0.3)
  Top 0.203: U1.4 36.17,27.84 v35.36,27.84 | U9.2 24.65,13.78 24.89,14.02 24.89,15.14 v24.59,15.44
  Bottom 0.203: v24.59,15.44 24.59,18.8 24.99,19.2 24.99,26.52 25.5,27.02 33.84,27.02 34.65,27.84 v35.36,27.84
ACC2_PWR_EN  (via drill 0.3)
  Top 0.203: U3.4 36.66,31.11 v36.68,31.09 | U9.3 24.15,13.89 24.49,14.22 24.49,14.63 v23.77,15.34
  Bottom 0.203: v23.77,15.34 23.77,18.59 24.59,19.41 24.59,26.72 27.83,29.97 36.37,29.97 36.68,30.28 v36.68,31.09
ACC_OC_DETECT  (via drill 0.3)
  Top 0.203: v30.68,13.61 30.68,16.15 31.19,16.66 31.19,22.76 32.11,23.67 32.11,24.38 32.34,24.62 U5.3 32.83,25.19 v33.22,24.79 | 36.29,25.22 U1.3 36.17,25.23 v36.17,26.42 36.78,27.03 36.78,29.47 U3.3 | U9.25 19.65,8.17 20.22,8.74 v20.22,12.09
  Route15 0.203: v33.22,24.79 34.54,24.79 v36.17,26.42
  Bottom 0.203: v20.22,12.09 20.22,12.29 20.73,12.8 24.69,12.8 25.5,13.61 v30.68,13.61
ACC_POWER  (via drill 0.5)
  Top 0.635: v41.25,26.31 L12.2
  Route15 0.635: v41.25,26.31 42.67,26.31 43.28,25.7 43.28,11.32 42.57,10.61 J9.1
  Bottom 0.381: 35.15,8.94 35.26,8.94
  Bottom 0.635: J7.3 31.57,8.71 32.51,9.65 34.44,9.65 35.15,8.94 | 35.26,8.94 37.69,8.94 39.37,10.61 J9.1 40.59,10.57 42.77,10.57 43.18,10.16 43.18,8.74 43.84,8.07 J11.1
ADC1_IN4  (via drill 0.3)
  Top 0.203: C2.1 10.46,21.23 12.29,19.41 15.65,19.41 16.15,18.9 16.15,18.09 13.92,15.85 v13.92,11.79 | U9.14 18.93,10.94 v19,10.87
  Top 0.305: R4.1 R5.2 C2.1
  Bottom 0.203: v19,10.87 14.83,10.87 v13.92,11.79
ANALOG1
  Top 0.203: R18.2 C12.1 37.86,29.83 38.2,30.18 41.15,30.18 41.76,29.57 43.26,29.57 J1.28 43.38,29.57 45.31,29.57 45.82,30.07 45.82,31.8 47.28,33.26 R17.1
BB_I2C2_SCL  (via drill 0.3)
  Top 0.203: U9.42 27.94,8.44 28.14,8.64 28.14,18.39 v28.35,18.59 | v46.94,19.51 J1.17
  Bottom 0.203: v28.35,18.59 46.02,18.59 v46.94,19.51
BB_I2C2_SDA  (via drill 0.3)
  Top 0.203: U9.43 27.63,8.94 27.74,9.04 v27.74,20.02 | v41.66,19.51 J1.18
  Bottom 0.203: v27.74,20.02 32.11,20.02 33.02,20.93 38.91,20.93 39.52,21.54 41.15,21.54 41.66,21.03 v41.66,19.51
BB_I2C3_SCL  (via drill 0.3)
  Top 0.203: v46.23,12.09 46.84,11.48 48.63,11.48 J1.9 | R10.1 36.37,9.25 36.07,9.55 36.07,10.77 v36.17,10.87
  Bottom 0.203: v36.17,10.87 36.37,10.67 37.29,10.67 38.71,12.09 v46.23,12.09
BB_I2C3_SDA  (via drill 0.3)
  Top 0.203: v44.91,11.48 43.32,11.48 | v36.78,9.96 36.78,9.86 37.9,8.74 37.89,8.74 R15.1 | 43.32,11.48 43.29,11.48 | 43.32,11.48 J1.10
  Bottom 0.203: v36.78,9.96 37.39,9.96 39.01,11.58 44.81,11.58 v44.91,11.48
BB_UART5_RX  (via drill 0.3)
  Top 0.203: J1.16 43.29,17.48 | U9.12 19.37,12.9 v19,12.9 | J1.16 43.35,17.48 | v41.66,17.48 41.69,17.51 J1.16
  Bottom 0.203: v19,12.9 19.3,13.21 24.49,13.21 25.6,14.33 25.6,16.97 26.11,17.48 28.75,17.48 29.06,17.78 41.35,17.78 v41.66,17.48
BB_UART5_TX  (via drill 0.3)
  Top 0.203: U9.13 17.98,11.52 v17.98,12.9 | v46.94,17.48 48.6,17.48 J1.15
  Bottom 0.203: v17.98,12.9 18.69,13.61 24.28,13.61 25.2,14.53 25.2,17.17 25.91,17.88 28.55,17.88 28.85,18.19 46.23,18.19 v46.94,17.48
BB_USART1_RX  (via drill 0.3)
  Top 0.203: v46.94,6.6 46.94,7.21 44.65,9.51 J1.8
  Bottom 0.203: J11.3 46.42,5.57 46.94,6.1 v46.94,6.6
BB_USART1_TX  (via drill 0.3)
  Top 0.203: v46.94,8.84 47.61,9.51 J1.7
  Bottom 0.203: J11.2 46.24,6.82 46.94,7.52 v46.94,8.84
BOOT0  (via drill 0.3)
  Top 0.203: U9.44 26.2,9.44 v25.81,9.04 | v28.75,9.86 28.92,10.02 R1.1
  Bottom 0.203: BOOT0.P$1 25.4,9.45 v25.81,9.04 27.94,9.04 v28.75,9.86
CAN1_RX
  Top 0.203: U7.4 40.82,13.84 41.55,13.11 41.55,7.92 41.96,7.52 43.31,7.52 J1.6
CAN1_TX  (via drill 0.3)
  Top 0.203: J1.5 47.25,7.51 46.23,8.53 46.23,9.75 v45.52,10.46 | v39.42,9.14 39.52,9.14 U7.1
  Route2 0.203: v45.52,10.46 42.57,10.46 41.55,11.48 39.52,11.48 39.22,11.18 39.22,9.35 v39.42,9.14
CH1
  Top 0.203: U9.10 20.65,13.99 20.22,14.43 19.1,14.43 18.84,14.16 U2.10
CH2
  Top 0.203: U9.11 20.15,13.78 19.91,14.02 19.3,14.02 18.8,13.51 U2.9
CH3  (via drill 0.3)
  Top 0.203: v24.08,11.38 24.08,10.87 25.01,9.94 U9.45 | v17.07,12.9 17.03,12.86 U2.8
  Bottom 0.203: v24.08,11.38 23.67,10.97 20.42,10.97 19.1,12.29 17.68,12.29 v17.07,12.9
CH4  (via drill 0.3)
  Top 0.203: U9.46 25.63,10.44 v24.89,11.18 | v16.97,12.09 16.84,12.21 U2.7
  Bottom 0.203: v16.97,12.09 17.17,11.89 18.9,11.89 20.22,10.57 24.28,10.57 v24.89,11.18
CH5
  Top 0.203: 15.83,11.48 U2.6 16.38,11.56 16.66,11.28 16.66,10.57 17.29,9.94 U9.16
CH6  (via drill 0.3)
  Top 0.203: U2.5 15.79,10.87 14.73,10.87 14.53,10.67 v14.53,9.75 | U9.17 17.91,9.45 v19,9.45
  Bottom 0.203: v14.53,9.75 18.69,9.75 v19,9.45
CH7
  Top 0.203: U9.18 17.17,8.94 17.07,9.04 17.07,9.55 16.36,10.26 U2.4
CH8
  Top 0.203: U9.19 16.96,8.44 16.66,8.74 16.66,9.35 16.4,9.61 U2.3
GND  (via drill 0.3, 0.5)
  Top 0.254: U9.35 24.65,3.52 23.82,2.69 C9.2 | U3.2 35.71,31.04 v35.76,31.09 | U9.47 26.15,10.94 v25.81,11.28 | 35.26,25.27 v35.26,26.62 | U5.2 31.39,24.18 v31.29,24.08 | SSR1.2 34.14,21.84 33.53,21.84 v33.22,22.15 | R5.1 8.43,22.66 v7.82,22.05 | J3.2 40.45,27.74 R18.1 C12.2 | U10.1 20.73,22.17 v20.73,22.15 | Q1.3 10.4,28.48 v10.46,28.55 | v29.46,23.06 29.79,22.73 SSR2.2 | R2.2 v6.81,25.09 | v41.55,5.49 41.58,5.51 | v21.84,12.09 21.65,12.28 U9.8 | C8.2 v26.72,15.44 25.59,16.57 C5.2 | U9.23 16.82,6.44 C10.2
  Top 0.381: J1.3 47.88,5.51 | v46.94,28.55 47.9,29.51 J1.27 | R5.1 C2.2 | 11.38,8.23 10.06,6.91 R13.1 10,7.01 9.96,7.01 8.65,5.7 C1.2 | 11.38,8.23 v11.38,8.53 11.38,9.35 11.11,9.61 U2.22 | U6.2 12.29,7.32 11.38,8.23 | U2.11 U2.12 15.75,16.06 16.6,16.91 C4.2 17.42,16.86 C6.1 20.36,18.22 21.11,18.22 X1.4 21.13,18.19 21.13,18.8 v20.62,19.3 20.56,19.36 R16.1 19,19.36 18.96,19.41 U4.2 | v31.29,24.08 v31.3,24.08 | U1.2 35.26,25.27 | SSR2.2 29.77,21.87 | R3.2 14.69,5.65 v15.34,6.3 15.94,6.9 C10.2 | U2.13 v9.96,16.15 | R1.2 29.2,11.32 v28.75,10.87 | J13.3 22.35,1.73 22.95,2.33 C9.2 | C5.2 23.45,16.57 X1.2
  Top 0.406: U7.2 37.16,11.3 v36.98,11.48
  Top 1.016: C7.C 19.32,31.78 U8.2 | C11.C 22.58,25.81 v21.74,25.81 | J1.3 46.86,5.51 46.84,5.49 43.34,5.49 J1.4 41.58,5.51
  Bottom 0.254: J11.4 45.09,4.27 | GND..P$1 21.23,3.25 22.25,2.23 22.25,1.76 J13.3
  Bottom 0.381: J5.3 46.5,28.11 v46.94,28.55 | 45.09,4.27 43.18,4.27 41.96,5.49 v41.55,5.49
  Bottom 1.016: GND.1 5.49,33.43 6.91,32 J10.2
  pour Route2 (isolate 0.254): 49.17,0.2 49.78,0.81 49.78,34.34 49.28,34.85 0.71,34.85 0.2,34.34 0.2,0.61 0.61,0.2
JTCK-SWCLK  (via drill 0.3)
  Top 0.203: U9.37 27.03,5.81 27.03,3.96 v27.33,3.66
  Bottom 0.203: v27.33,3.66 28.45,3.66 28.7,3.4 | J12.4 28.7,3.4 | 28.7,3.4 JTCK-SWCLK.P$1
JTDI
  Top 0.203: U9.38 26.25,6.44 26.01,6.2 26.01,3.86 27.05,2.82 J12.8
  Bottom 0.203: JTDI.P$1 26.87,3 26.87,2.69 J12.8
JTDO  (via drill 0.3)
  Top 0.203: J12.6 28.14,2.69 28.14,6.71 28.17,6.73 28.17,6.94 | 28.17,6.94 U9.39 | 28.17,6.94 v28.35,7.11
  Bottom 0.203: JTDO.P$1 27.84,7.62 v28.35,7.11
JTMS-SWDIO  (via drill 0.3)
  Top 0.203: U9.34 24.15,5.15 v24.28,5.28
  Bottom 0.203: v24.28,5.28 28.35,5.28 30.86,2.77 J12.2 31.39,3.05 JTMS-SWDIO.P$1
LED1
  Top 0.203: U9.27 20.65,3.48 20.52,3.35 17.94,3.35 R8.1
LED2
  Top 0.203: U9.28 21.15,3.37 20.73,2.95 18.96,2.95 R12.1
LED3  (via drill 0.3)
  Top 0.203: v12.6,15.95 12.6,10.36 v12.9,10.06 | v6.81,33.63 R11.2 | v19,8.33 19,7.72 18.71,7.44 U9.21
  Route15 0.203: v12.6,15.95 12.6,16.87 10.06,19.41 10.06,23.06 8.64,24.49 6.5,24.49 5.79,25.2 5.79,31.19 6.81,32.21 v6.81,33.63
  Bottom 0.203: v12.9,10.06 12.9,9.65 14.63,7.92 18.59,7.92 v19,8.33
N$1
  Top 0.203: SSR2.1 32.33,22.94 R7.2
N$2
  Top 0.203: R6.2 36.63,22.77 SSR1.1
N$4  (via drill 0.5)
  Top 0.254: 30.44,23.23 v30.38,23.16 | 37.9,26.27 L12.1
  Top 0.635: U5.1 30.44,23.23 | v38.51,23.16 38.51,24.18 37.9,24.79 37.9,26.27
  Bottom 0.635: v30.38,23.16 v38.51,23.16
N$5
  Top 0.203: U9.6 22.65,14.53 21.23,15.95 21.23,16.39 X1.1 20.23,15.55 C6.2
N$6
  Top 0.203: U9.5 23.15,14.85 22.25,15.75 22.25,17.27 22.66,17.68 22.86,17.68 X1.3 23.65,17.87 C5.1
N$7
  Top 0.203: L2.1 8.8,24.2 R4.2
N$8
  Top 0.203: LED1.C R8.2
N$9
  Top 0.406: R16.2 22.04,20.66 U8.4
N$10
  Top 0.203: R11.1 4.17,33.63 3.76,33.22 3.76,31.9 3.25,31.39 3.25,29.67 3.56,29.36 X2.2
N$14  (via drill 0.5)
  Top 0.203: 32.3,7.52 L4.1
  Top 0.635: v31.09,7.52 32.3,7.52 | v32.92,1.02 35.36,1.02 35.62,1.28 F1.2
  Bottom 0.635: v31.09,7.52 32.41,6.2 32.41,1.52 v32.92,1.02
N$15  (via drill 0.3)
  Top 0.203: R17.2 45.98,33.18 v45.92,33.12
  Bottom 0.203: v45.92,33.12 45.92,32 46.74,31.19 46.74,29.77 46.33,29.36 J5.2
N$21  (via drill 0.5)
  Top 0.635: v33.43,20.22 32.33,19.13 SSR2.4
  Bottom 0.635: 40.54,20.62 J8.1 40.54,20.56 39.56,20.56 39.22,20.22 v33.43,20.22
N$22  (via drill 0.5)
  Top 0.635: v30.48,19.3 30.48,17.17 29.79,16.48 SSR2.3
  Bottom 0.254: v30.48,19.3 30.49,19.31
  Bottom 0.635: 30.49,19.31 40.54,19.31 | 40.54,19.31 40.54,19.3 | 40.54,19.31 J8.2
N$23  (via drill 0.5)
  Top 0.635: SSR1.3 34.04,15.65 v34.04,16.87
  Bottom 0.635: J6.2 35.88,15.02 v34.04,16.87
N$24
  Top 0.381: SSR1.4 36.68,15.65
  Top 0.635: 36.68,15.65 37.3,16.27 J6.1
N$27
  Top 0.203: J9.3 39.81,8.11 38.81,7.11 38.29,7.11 R15.2
N$28  (via drill 0.3)
  Top 0.203: R10.2 36.64,7.07 36.68,7.11 v37.29,7.11
  Bottom 0.203: v37.29,7.11 38.29,7.11 J9.2
N$29  (via drill 0.5)
  Top 0.254: U1.1 34.24,25.23
  Top 0.635: 34.24,25.23 v34.24,26.42
  Bottom 0.635: J2.1 35.85,24.81 v34.24,26.42
N$30  (via drill 0.5)
  Top 0.508: U3.1 33.95,29.59
  Top 0.635: 33.95,29.59 v33.12,28.75
  Bottom 0.635: v33.12,28.75 33.44,29.07 J3.1
N$31
  Top 0.203: R12.2 17.62,0.3 14.43,0.3 13.92,0.81 LED2.C
N$38
  Top 0.203: LED4.C 11.58,1.89 11.58,3.66 10.06,5.18 R13.2
N$43
  Top 0.203: R14.1 33.02,6.34 J15.2 34.95,7.56 34.95,10.97 34.75,11.18 33.53,11.18 U7.7
N$44
  Top 0.203: R14.2 32.4,4.34 J15.3 35.46,6.06 35.46,11.28 34.24,12.5 33.48,12.5 U7.6
N$47
  Top 0.635: J15.1 33.19,8.88 L4.2
NRST  (via drill 0.3)
  Top 0.203: U9.7 22.15,14.22 21.54,14.83 18.15,14.83 v18.11,14.86 C4.1
  Bottom 0.203: !RESET.P$1 18.32,14.86 v18.11,14.86
PB2-BOOT1
  Top 0.203: R3.1 15.05,7.62 16.87,7.62 17.18,7.94 U9.20
PPM1
  Top 0.203: U2.14 9.27,14.81 9.04,15.04 9.04,16.26 8.23,17.07 8.23,18.39 7.62,19 7.62,21.03 6.25,22.4 J16.22
PPM2
  Top 0.203: J16.19 6.25,19.56 7.72,18.09 7.72,16.87 8.53,16.05 8.53,14.53 8.9,14.16 U2.15
PPM3
  Top 0.203: J16.16 8.03,15.8 8.03,14.02 8.54,13.51 U2.16
PPM4
  Top 0.203: J16.13 7.52,13.77 7.52,13.61 8.27,12.86 U2.17
PPM5
  Top 0.203: J16.10 6.53,12.21 U2.18
PPM6
  Top 0.203: J16.7 7.85,11.56 U2.19
PPM7
  Top 0.203: J16.4 6.25,7.98 9.14,10.87 9.91,10.87 U2.20
PPM8
  Top 0.203: J16.1 7.62,6.25 7.62,8.53 9.35,10.26 U2.21
PPM_INPUT  (via drill 0.3)
  Top 0.203: J1.23 v46.13,25.5 | U9.29 v21.64,6.91 21.64,10.77 22.66,11.79 v22.66,12.09 | U6.1 12.94,7.56 v13.01,7.62 | v31.39,12.6 31.39,16.15 31.6,16.36 31.6,20.52 v31.8,20.73
  Bottom 0.203: v21.64,6.91 13.72,6.91 v13.01,7.62 11.79,7.62 6.3,2.13 J4.1 | v46.13,25.5 46.02,25.5 42.47,21.95 39.32,21.95 38.71,21.34 32.41,21.34 v31.8,20.73 | v22.66,12.09 22.96,12.39 31.19,12.39 v31.39,12.6
RELAY1  (via drill 0.3)
  Top 0.203: U9.33 23.67,4.21 23.67,9.55 v23.88,9.75 | v36.27,12.09 36.27,12.9 35.76,13.41 35.76,23.06 36.08,23.38 R6.1
  Bottom 0.203: v23.88,9.75 24.28,10.16 26.31,10.16 27.74,11.58 35.76,11.58 v36.27,12.09
RELAY2  (via drill 0.3)
  Top 0.203: U9.32 23.15,11.57 v23.37,11.79 | v35.46,12.6 35.26,12.8 35.26,22.45 34.22,23.49 R7.1
  Bottom 0.203: v23.37,11.79 23.57,11.99 34.85,11.99 v35.46,12.6
SAFETY  (via drill 0.3)
  Top 0.203: U9.41 25.41,7.94 v25.4,7.92 | v11.89,10.06 v11.89,16.56 | 4.81,28.14 X2.3 4.77,28.04 4.27,28.04 3.66,27.43 3.66,25.6 4.17,25.09 R2.1 4.63,24.53 v5.08,24.08
  Route15 0.203: v11.89,16.56 9.65,18.8 9.65,22.86 8.43,24.08 v5.08,24.08
  Bottom 0.203: v25.4,7.92 24.99,7.52 14.43,7.52 v11.89,10.06
SERVO_OC_DETECT  (via drill 0.3)
  Top 0.203: U4.3 16.9,20.36 16.66,20.12 16.66,17.88 14.53,15.75 14.53,11.38 13.82,10.67 v13.82,10.36 | v21.03,8.43 20.15,7.55 U9.26
  Bottom 0.203: v13.82,10.36 14.94,10.36 15.14,10.16 19.3,10.16 v21.03,8.43
SERVO_PWR_EN  (via drill 0.3)
  Top 0.203: 23.67,13.19 U9.4 23.65,14.31 v23.77,14.43 | v15.04,21.23 15.04,20.38 U4.4 | v13.31,14.22 v13.31,16.56
  Route15 0.203: v13.31,16.56 13.31,17.88 15.04,19.61 v15.04,21.23
  Bottom 0.203: v23.77,14.43 23.57,14.22 v13.31,14.22
USART1_RX  (via drill 0.3)
  Top 0.203: J13.2 22.65,3.35 U9.31 22.65,5.79 v22.55,5.89
  Bottom 0.203: USART1_RX.P$1 19.71,3.56 21.03,2.23 J13.2 | J7.1 29.49,5.89 v22.55,5.89
USART1_TX
  Top 0.203: U9.30 22.15,3.56 21.13,2.54 20.02,2.54 19.78,2.31 J13.1
  Bottom 0.203: USART1_TX.P$1 17.27,3.56 19.1,1.73 J13.1
USART3_RX
  Top 0.203: U6.6 13.46,4.27 17.88,4.27 18.9,5.28 18.9,6.6 18.57,6.94 U9.22
VDD_3V3  (via drill 0.3, 0.5)
  Top 0.203: U9.1 25.17,13.21
  Top 0.254: 24.79,2.85 25.15,3.21 U9.36 | U9.48 25.81,12.53 v25.81,13.01 | 25.17,13.21 25.6,13.21 v25.81,13.01 | v25.81,13.01 26.01,13.21 26.66,13.21 C8.1 | X2.1 5.21,30.61 5.99,31.39 7.52,31.39 8.03,30.89 v11.18,30.89 | U5.4 31.4,27.79 v31.4,27.84 | v21.03,12.09 21.15,12.21 U9.9 | U9.24 16.7,5.94 C10.1
  Top 0.381: C9.1 24.29,1.03 v24.79,1.52 24.79,2.85 | 14.43,2.58 LED2.A LED4.A 12.29,2.58 U6.5 | 14.43,2.58 LED1.A 15.44,2.54 | U2.1 U2.2 14.55,8.96 v14.53,8.94 | U5.5 30.44,27.84 | v14.73,3.45 14.73,2.88 14.43,2.58
  Top 0.406: v17.27,4.98 16.98,4.98 C10.1 | U7.3 37.01,12.57 v36.98,12.6
  Top 0.635: U5.5 31.4,27.79
  Top 0.813: U10.2 v20.73,24.49
  Top 1.016: v20.73,24.49 22.48,24.49 C11.A
  Bottom 0.254: v11.18,30.89 11.38,30.89 11.68,30.58 v11.68,26.92 | VDD_3V3.P$1 14.63,3.56 v14.73,3.45
  other vias: 14.12,24.49 12.5,26.92 13.31,26.92 14.83,26.62 14.12,25.3 14.12,26.11 14.12,22.86 14.83,23.27 14.83,24.08 14.83,24.89 14.83,25.7 14.83,22.45 14.12,26.92 14.12,23.67
  pour Route15 (isolate 0.305): 10.77,30.48 10.77,0.2 38.1,0.2 38.1,30.48
  pour Top (no thermals): 11.07,23.06 11.07,26.82 11.48,27.23 14.83,27.23 15.24,26.82 15.24,22.45 14.94,22.15 14.12,22.15 13.61,22.66 11.48,22.66
VDD_5V  (via drill 0.3, 0.5)
  Top 0.254: L3.1 42.67,34.2 v42.67,33.12 | 34.07,27.64 U1.5
  Top 0.381: v34.24,31.19 34.25,31.21 | U1.5 34.24,27.8 | v46.94,3.45 46.99,3.51
  Top 0.635: 34.25,31.21 34.76,31.71 U3.5 | J1.2 43.28,3.47 | D1.CATHODE 12.9,17.78 13.58,18.46 U4.5 | F1.1 36.51,2.98 v37.08,3.56 | v33.43,27.64 34.07,27.64
  Top 0.813: v16.36,21.95 16.36,26.01 17.14,26.8 U10.3 20.8,26.8 22.05,28.04 22.28,28.04 D2.CATHODE | 12.9,17.78 13.72,17.78 v14.12,17.37
  Top 1.016: J1.2 46.99,3.51 J1.1 | v26.31,29.97 25.7,29.36 D2.CATHODE
  Route15 0.254: v46.94,3.45 46.84,3.45 | v42.67,33.12 42.06,32.51 42.06,30.28
  Route15 0.635: v34.24,31.19 34.24,29.97 34.24,28.45 v33.43,27.64 | v37.08,3.56 37.9,4.37 45.92,4.37 46.84,3.45
  Route15 0.813: v14.12,17.37 16.36,19.61 v16.36,21.95
  Route15 1.016: v46.94,3.45 47.55,3.45 48.87,4.78 48.87,24.59 43.18,30.28 42.06,30.28 37.59,30.28 37.29,29.97 34.24,29.97 v26.31,29.97
VDD_5V_ANALOG  (via drill 0.3)
  Top 0.254: L3.2 43.93,33.18 v43.99,33.12
  Bottom 0.254: v43.99,33.12 45.15,31.96 J5.1
VDD_SERVO  (via drill 0.3, 0.5)
  Top 0.254: C1.1 8.53,7
  Top 0.381: U2.23 U2.24 9.87,8.23 v8.53,8.23 | D1.ANODE 10.37,16.96 11.18,16.15 v11.18,10.36 | U4.1 17.68,18.49
  Top 0.406: 8.53,7 v8.53,8.23
  Top 0.508: v19,18.29 18.8,18.49 17.68,18.49 17.29,18.49
  Top 0.762: L1.2 10.09,18.06 D1.ANODE
  Top 0.813: D1.ANODE 10.2,17.96 10.14,17.96 9.35,17.17 v9.38,17.17
  Bottom 0.381: v8.53,8.23 9.04,8.23 v11.18,10.36
  Bottom 0.635: v19,18.29 18.8,18.49 10.46,18.49 9.38,17.41 v9.38,17.17
VDD_SERVO_EXT  (via drill 0.5)
  Top 0.61: 8.79,18.84 v8.84,18.8
  Top 0.813: L1.1 8.79,18.84
  Route15 0.254: 8.03,21.13 7.77,21.39 3.71,21.39 | 8.03,18.85 3.71,18.85 | 8.03,16.31 3.66,16.31 | 8.03,13.77 3.66,13.77 | 8.03,11.23 3.71,11.23 | 8.03,8.94 7.77,8.69 3.66,8.69
  Route15 0.61: 8.03,18.8 8.03,18.85
  Route15 0.635: v8.84,18.8 8.03,18.8 8.03,16.31 8.03,13.77 8.03,11.23 8.03,8.94 | 8.03,18.85 8.03,21.13
  Bottom 0.254: J16.20 3.76,20.12 | 8.03,8.94 7.77,8.69 3.71,8.69 | 8.03,18.85 3.71,18.85 | 8.03,16.31 3.66,16.31 | 8.03,13.77 3.66,13.77 | 8.03,11.23 3.71,11.23 | 8.03,21.13 7.77,21.39 3.71,21.39
  Bottom 0.61: 8.03,18.8 8.03,18.85
  Bottom 0.635: v8.84,18.8 8.03,18.8 8.03,16.31 8.03,13.77 8.03,11.23 8.03,8.94 | 8.03,18.85 8.03,21.13
  Bottom 1.016: J16.23 3.71,21.39 J16.20 3.71,18.85 J16.17 J16.14 J16.11 3.71,11.23 J16.8 3.71,8.69 J16.5 J16.2 3.76,4.88 J4.2
VIN  (via drill 0.3, 0.5)
  Top 0.254: L2.2 v7.92,25.5
  Top 0.635: 11.99,29.87 12.39,29.87 12.64,29.63
  Top 0.762: 11.99,29.87 10.42,29.87 Q1.4
  Top 0.813: v23.57,32.51 23.6,32.48 D3.CATHODE
  Top 1.016: U8.1 12.98,32.19 C7.A 12.64,29.63 12.48,29.46
  Route15 0.254: v7.92,25.5 9.35,26.92 9.35,30.28 12.45,33.38 U8.1
  Bottom 0.813: U8.1 16.36,31.19 22.35,31.19 23.57,32.41 v23.57,32.51
VIN_CONTACT
  Bottom 1.016: J10.1 6.91,26.82 5.38,25.3 6-18V.1
  pour Top (no thermals): 6.3,28.96 7.42,28.96 8.23,29.77 8.23,30.28 8.74,30.28 9.65,30.28 9.65,27.03 8.23,27.03 7.42,27.84 6.3,27.84
VOUT
  Top 0.813: D2.ANODE D3.ANODE 21.7,32.96 U8.3

### Text on the board
tPlace: PX2IO v1.1
tDocu: S1 | S8
bDocu: RST | BOOT